# EAGLE board perspection-v1 (EAGLE 6.6.0), part 1 of 2
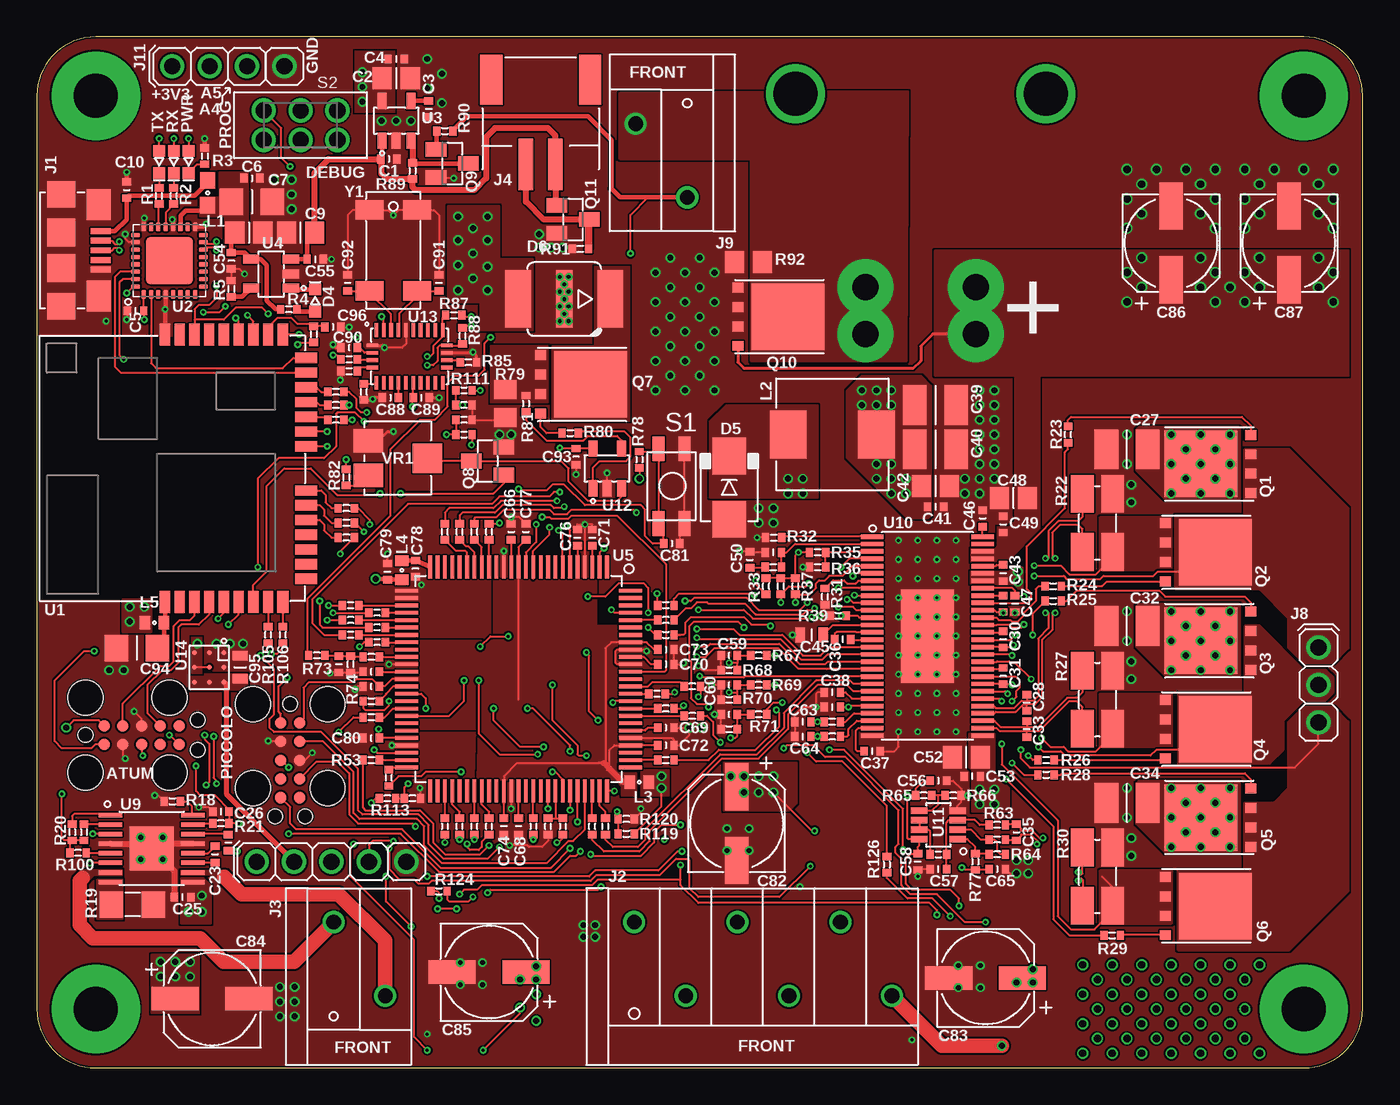
[diagram p8: board, top side]
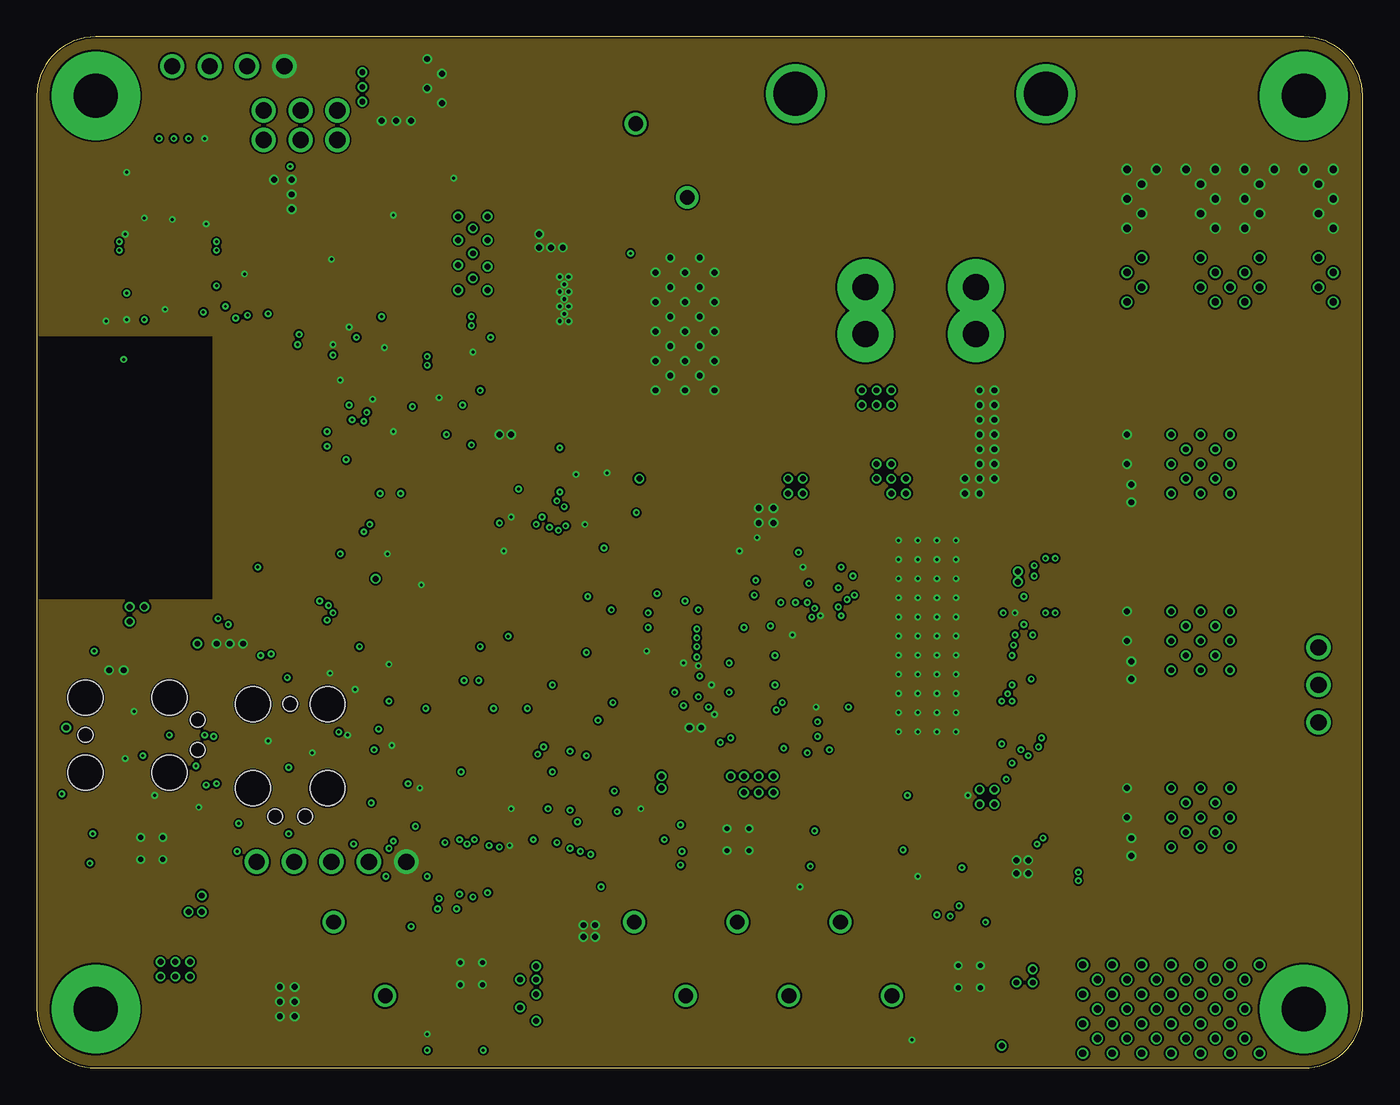
[diagram p9: board, inner layer Route2]
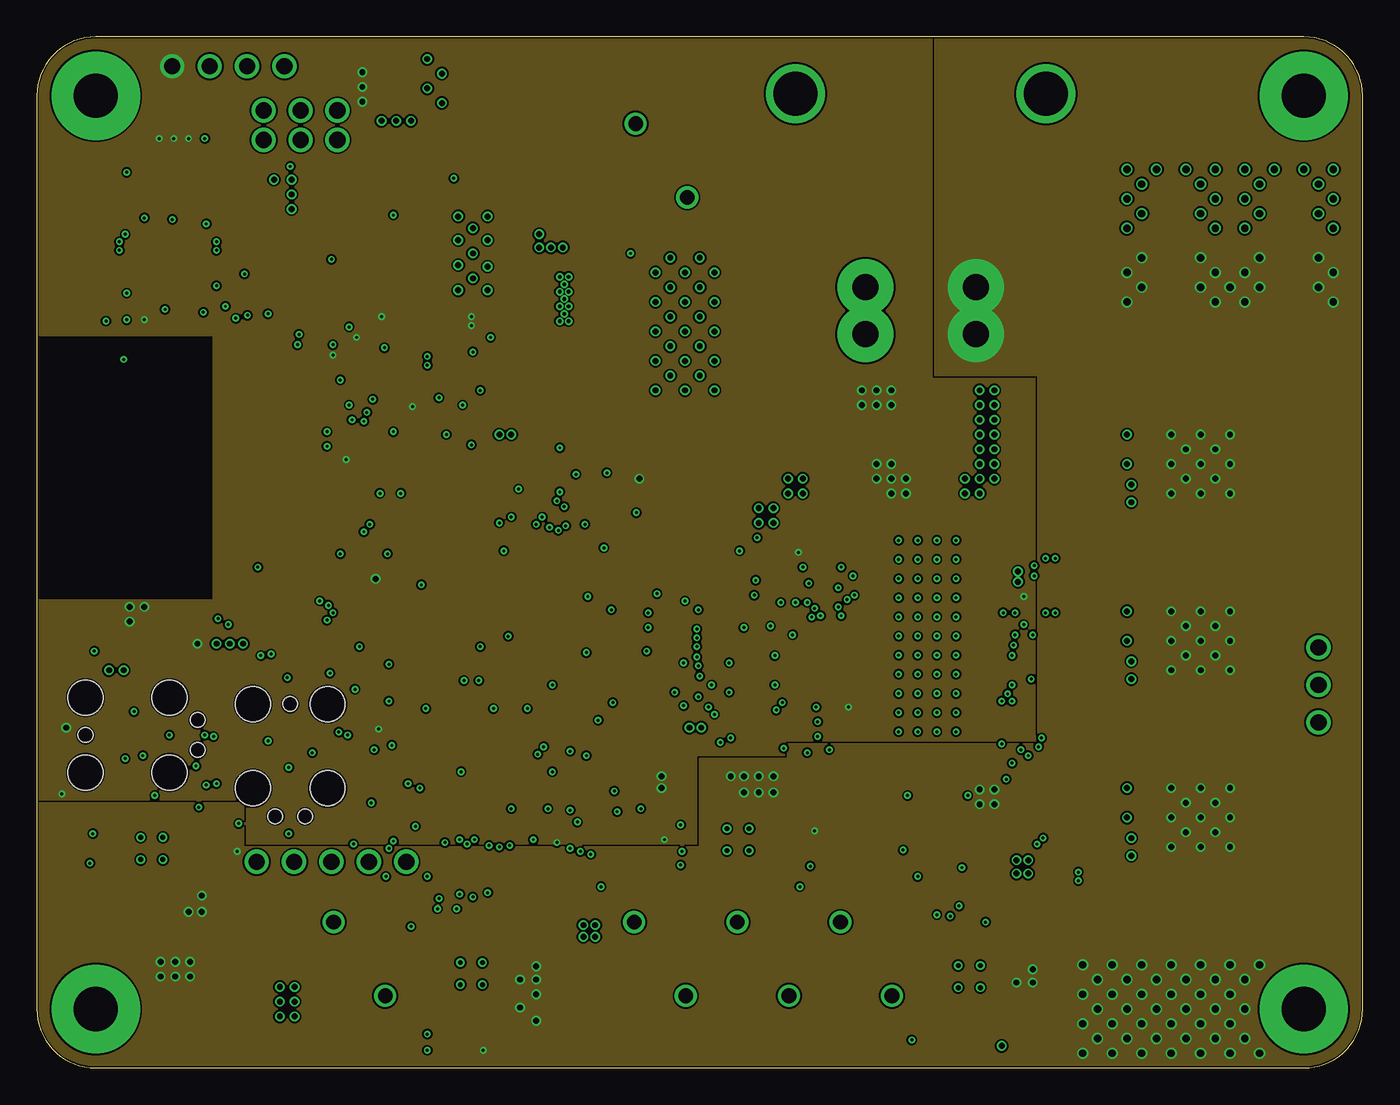
[diagram p10: board, inner layer Route15]
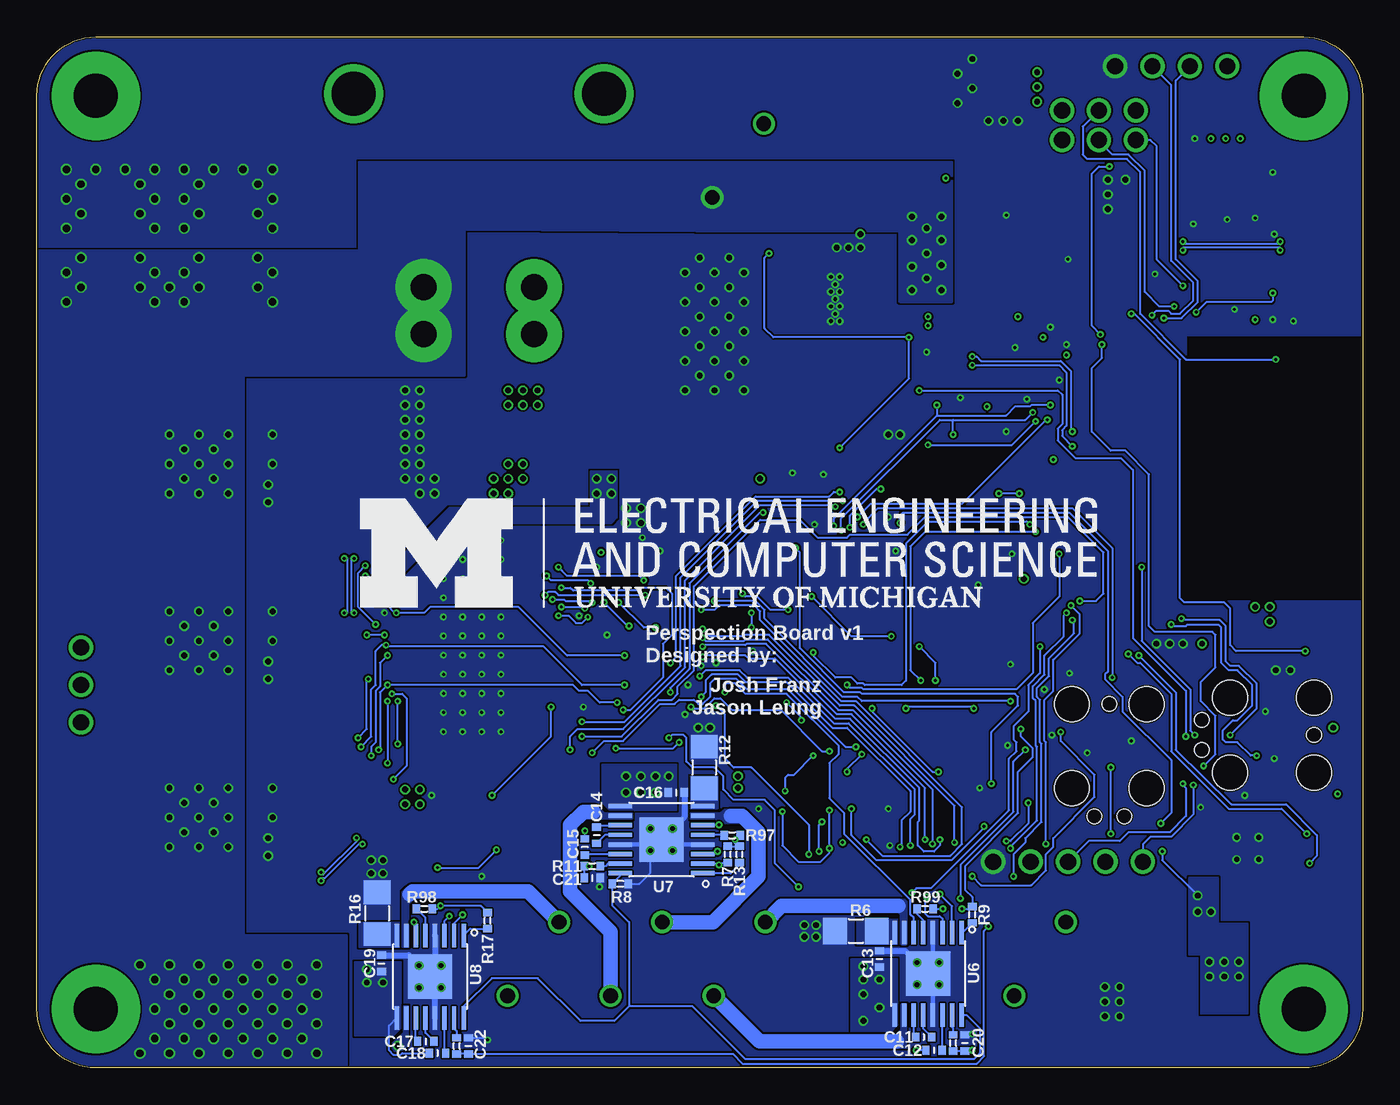
[diagram p11: board, bottom side, seen from below]

Size 90 x 70 mm. Coordinates in mm from the lower left corner, seen from the top.
Outline: 4,0 86,0 arc90 90,4 90,66 arc90 86,70 4,70 arc90 0,66 0,4 arc90 4,0
Copper layers (1*2*15*16): Top 0.035mm / dielectric 1.5mm / Route2 0.035mm / dielectric 0.15mm / Route15 0.035mm / dielectric 0.2mm / Bottom 0.035mm
Design rules "default *": minimum track width 5mil, minimum drill 0.2mm, track to track 5mil, track to pad 5mil, pad to pad 5mil, via to via 5mil, smd to smd 0mil, copper to edge 5mil, drill to drill 8mil, minimum pad ring 5mil, minimum via ring 5mil, stop-mask expansion 4mil, vias tented up to drill 8mil, thermal gap 10mil

## Footprints (pad centres in the part's own frame; a part is rotated, then mirrored left to right if it is on the bottom)
C0402 = smd 0.5 x 0.6: 1 -0.55,0; 2 0.55,0
C0805 = smd 1.3 x 1.5: 1 -0.95,0; 2 0.95,0
C1206 = smd 1.6 x 1.8: 1 -1.4,0; 2 1.4,0
C1210 = smd 1.6 x 2.7: 1 -1.4,0; 2 1.4,0
C0603 = smd 0.65 x 1: 1 -0.775,0; 2 0.775,0
PANASONIC-6.3MM-SMD = smd 1.6 x 3.2: NEG 0,-2.5; POS 0,2.5
LED0603 = smd 0.8 x 0.8: ANODE -0.75,0; CATHODE 0.75,0
SMB = smd 2.5 x 2.3: A 2.15,0; C -2.15,0
XLAMP-MX3 = smd 1.75 x 3.9: ANODE -3.125,0; CATHODE 3.125,0 | smd 1.1 x 3.9: THERM 0,0 | drill 0.254 pad 0.406: THERM1 0,0; THERM2 0,1; THERM3 0,-1; THERM4 -0.3,1.5; THERM5 0.3,1.5; THERM6 -0.3,0.5; THERM7 0.3,0.5; THERM8 -0.3,-0.5; THERM9 0.3,-0.5; THERM10 0.3,-1.5; THERM11 -0.3,-1.5
MICRO-USB = smd 0.4 x 1.35: 1 -1.3,4.125; 2 -0.65,4.125; 3 0,4.125; 4 0.65,4.125; 5 1.3,4.125 | smd 2.1 x 1.6: CASE1 -3.1,4; CASE2 3.1,4 | smd 1.8 x 1.9: CASE3 -3.8,1.45; CASE6 3.8,1.45 | smd 1.9 x 1.9: CASE4 -1.2,1.45; CASE5 1.2,1.45
3.5MM_PTSA_1.5/6-3.5-Z = drill 1: 1 -8.75,5; 2 -5.25,0; 3 -1.75,5; 4 1.75,0; 5 5.25,5; 6 8.75,0
3.5MM_PTSA_1.5/2-3.5-Z = drill 1: 1 -1.75,5; 2 1.75,0
JST-PH-2-SMD = smd 1 x 3.5: 1 1,-7.25; 2 -1,-7.25 | smd 1.5 x 3.4: CASE1 3.35,-1.5; CASE2 -3.35,-1.5
MOLEX_SABRE_2POS = drill 1.778 pad 3.81: N 3.747,0; N2 3.747,3.175; P -3.747,3.175; P2 -3.747,0 | drill 2.997: NC -8.496,-13.132; NC2 8.496,-13.132
TC2050-IDC = smd 0.787 x 0.787: 1 1.27,0.635; 2 2.54,0.635; 3 3.81,0.635; 4 5.08,0.635; 5 6.35,0.635; 6 6.35,-0.635; 7 5.08,-0.635; 8 3.81,-0.635; 9 2.54,-0.635; 10 1.27,-0.635 | hole 0.991: 7.62,1.016; 7.62,-1.016; 0,0 | hole 2.375: 0,2.54; 0,-2.54; 5.715,2.54; 5.715,-2.54
1X3_0.1IN_THRUHOLE = drill 1.1: 1 -2.54,0; 2 0,0; 3 2.54,0
1X5_0.1IN_THRUHOLE = drill 1.1: 1 -5.08,0; 2 -2.54,0; 3 0,0; 4 2.54,0; 5 5.08,0
1X4_0.1IN_THRUHOLE = drill 1.1: 1 -3.81,0; 2 -1.27,0; 3 1.27,0; 4 3.81,0
L0603 = smd 1.1 x 1: 1 -0.85,0; 2 0.85,0
DR74 = smd 2.5 x 3.25: 1 -3,0; 2 3,0
L0402 = smd 0.7 x 0.9: 1 -0.65,0; 2 0.65,0
SON-5X6 = smd 4.51 x 4.95: D 0,0 | smd 0.675 x 0.75: G 1.98,-3.405; S1 -1.98,-3.405; S2 -0.66,-3.405; S3 0.66,-3.405
SOT23 = smd 1 x 1.4: 1 -0.95,-1.1; 2 0.95,-1.1; 3 0,1.1
R0402 = smd 0.5 x 0.6: 1 -0.55,0; 2 0.55,0
R1206 = smd 1.6 x 1.803: 1 -1.422,0; 2 1.422,0
R2010-4 = smd 1.55 x 2.55: I1 -1.025,1.975; I2 -1.025,-1.975; V1 1.025,1.975; V2 1.025,-1.975
R0805 = smd 1.3 x 1.5: 1 -0.95,0; 2 0.95,0
EVQP2 = smd 1.676 x 0.813: 1 -2.54,-0.87; 2 -2.54,0.908; 3 2.54,-0.87; 4 2.54,0.908
SSA22/DPDT = drill 1.092: A1 2.5,1; A2 2.5,-1; B1 -2.5,1; B2 -2.5,-1; COM1 0,1; COM2 0,-1
ATUM = smd 1.5 x 0.7: 1 -9.079,0.5; 2 -9.079,-0.5; 3 -9.079,-1.5; 4 -9.079,-2.5; 5 -9.079,-3.5; 6 -9.079,-4.5; 7 -9.079,-5.5; 8 -9.079,-6.5; 24 9.079,-7.5; 25 9.079,-6.5; 26 9.079,-5.5; 27 9.079,-4.5; 28 9.079,-3.5; 29 9.079,-2.5; 30 9.079,-1.5; 31 9.079,-0.5; 32 9.079,0.5 | smd 1.5 x 0.754: 9 -9.079,-7.5 | smd 0.7 x 1.5: 10 -7.5,-9.079; 11 -6.5,-9.079; 12 -5.5,-9.079; 13 -4.5,-9.079; 14 -3.5,-9.079; 15 -2.5,-9.079; 16 -1.5,-9.079; 17 1.5,-9.079; 18 2.5,-9.079; 19 3.5,-9.079; 20 4.5,-9.079; 21 5.5,-9.079; 22 6.5,-9.079; 23 7.5,-9.079
QFN32 = smd 0.6 x 0.3: 1 -2.3,1.75; 2 -2.3,1.25; 3 -2.3,0.75; 4 -2.3,0.25; 5 -2.3,-0.25; 6 -2.3,-0.75; 7 -2.3,-1.25; 8 -2.3,-1.75; 17 2.3,-1.75; 18 2.3,-1.25; 19 2.3,-0.75; 20 2.3,-0.25; 21 2.3,0.25; 22 2.3,0.75; 23 2.3,1.25; 24 2.3,1.75 | smd 0.3 x 0.6: 9 -1.75,-2.3; 10 -1.25,-2.3; 11 -0.75,-2.3; 12 -0.25,-2.3; 13 0.25,-2.3; 14 0.75,-2.3; 15 1.25,-2.3; 16 1.75,-2.3; 25 1.75,2.3; 26 1.25,2.3; 27 0.75,2.3; 28 0.25,2.3; 29 -0.25,2.3; 30 -0.75,2.3; 31 -1.25,2.3; 32 -1.75,2.3 | smd 3.2 x 3.2: EXP 0,0
SOT23-5 = smd 0.6 x 1.1: 1 -0.95,-1.35; 2 0,-1.35; 3 1,-1.35; 4 1,1.35; 5 -0.95,1.35
TI-LQFP-100 = smd 0.25 x 1.55: 1 -6,-7.6; 2 -5.5,-7.6; 3 -5,-7.6; 4 -4.5,-7.6; 5 -4,-7.6; 6 -3.5,-7.6; 7 -3,-7.6; 8 -2.5,-7.6; 9 -2,-7.6; 10 -1.5,-7.6; 11 -1,-7.6; 12 -0.5,-7.6; 13 0,-7.6; 14 0.5,-7.6; 15 1,-7.6; 16 1.5,-7.6; 17 2,-7.6; 18 2.5,-7.6; 19 3,-7.6; 20 3.5,-7.6; 21 4,-7.6; 22 4.5,-7.6; 23 5,-7.6; 24 5.5,-7.6; 25 6,-7.6; 51 6,7.6; 52 5.5,7.6; 53 5,7.6; 54 4.5,7.6; 55 4,7.6; 56 3.5,7.6; 57 3,7.6; 58 2.5,7.6; 59 2,7.6; 60 1.5,7.6; 61 1,7.6; 62 0.5,7.6; 63 0,7.6; 64 -0.5,7.6; 65 -1,7.6; 66 -1.5,7.6; 67 -2,7.6; 68 -2.5,7.6; 69 -3,7.6; 70 -3.5,7.6; 71 -4,7.6; 72 -4.5,7.6; 73 -5,7.6; 74 -5.5,7.6; 75 -6,7.6 | smd 1.55 x 0.25: 26 7.6,-6; 27 7.6,-5.5; 28 7.6,-5; 29 7.6,-4.5; 30 7.6,-4; 31 7.6,-3.5; 32 7.6,-3; 33 7.6,-2.5; 34 7.6,-2; 35 7.6,-1.5; 36 7.6,-1; 37 7.6,-0.5; 38 7.6,0; 39 7.6,0.5; 40 7.6,1; 41 7.6,1.5; 42 7.6,2; 43 7.6,2.5; 44 7.6,3; 45 7.6,3.5; 46 7.6,4; 47 7.6,4.5; 48 7.6,5; 49 7.6,5.5; 50 7.6,6; 76 -7.6,6; 77 -7.6,5.5; 78 -7.6,5; 79 -7.6,4.5; 80 -7.6,4; 81 -7.6,3.5; 82 -7.6,3; 83 -7.6,2.5; 84 -7.6,2; 85 -7.6,1.5; 86 -7.6,1; 87 -7.6,0.5; 88 -7.6,0; 89 -7.6,-0.5; 90 -7.6,-1; 91 -7.6,-1.5; 92 -7.6,-2; 93 -7.6,-2.5; 94 -7.6,-3; 95 -7.6,-3.5; 96 -7.6,-4; 97 -7.6,-4.5; 98 -7.6,-5; 99 -7.6,-5.5; 100 -7.6,-6
TI-HTSSOP-16 = smd 0.3 x 1.6: 1 -2.275,-2.8; 2 -1.625,-2.8; 3 -0.975,-2.8; 4 -0.325,-2.8; 5 0.325,-2.8; 6 0.975,-2.8; 7 1.625,-2.8; 8 2.275,-2.8; 9 2.275,2.8; 10 1.625,2.8; 11 0.975,2.8; 12 0.325,2.8; 13 -0.325,2.8; 14 -0.975,2.8; 15 -1.625,2.8; 16 -2.275,2.8 | smd 3 x 3: PAD 0,0 | drill 0.33: THERM1 -0.75,0.75; THERM2 0.75,0.75; THERM3 -0.75,-0.75; THERM4 0.75,-0.75
TI-HTSSOP-56 = smd 0.3 x 1.55: 1 -6.75,-3.75; 2 -6.25,-3.75; 3 -5.75,-3.75; 4 -5.25,-3.75; 5 -4.75,-3.75; 6 -4.25,-3.75; 7 -3.75,-3.75; 8 -3.25,-3.75; 9 -2.75,-3.75; 10 -2.25,-3.75; 11 -1.75,-3.75; 12 -1.25,-3.75; 13 -0.75,-3.75; 14 -0.25,-3.75; 15 0.25,-3.75; 16 0.75,-3.75; 17 1.25,-3.75; 18 1.75,-3.75; 19 2.25,-3.75; 20 2.75,-3.75; 21 3.25,-3.75; 22 3.75,-3.75; 23 4.25,-3.75; 24 4.75,-3.75; 25 5.25,-3.75; 26 5.75,-3.75; 27 6.25,-3.75; 28 6.75,-3.75; 29 6.75,3.75; 30 6.25,3.75; 31 5.75,3.75; 32 5.25,3.75; 33 4.75,3.75; 34 4.25,3.75; 35 3.75,3.75; 36 3.25,3.75; 37 2.75,3.75; 38 2.25,3.75; 39 1.75,3.75; 40 1.25,3.75; 41 0.75,3.75; 42 0.25,3.75; 43 -0.25,3.75; 44 -0.75,3.75; 45 -1.25,3.75; 46 -1.75,3.75; 47 -2.25,3.75; 48 -2.75,3.75; 49 -3.25,3.75; 50 -3.75,3.75; 51 -4.25,3.75; 52 -4.75,3.75; 53 -5.25,3.75; 54 -5.75,3.75; 55 -6.25,3.75; 56 -6.75,3.75 | smd 6.35 x 3.61: 57 0,0 | drill 0.2 pad 0.406: P$58 0,0.65; P$59 0,1.95; P$60 0,-1.95; P$61 0,-0.65; P$62 1.3,0.65; P$63 1.3,1.95; P$64 1.3,-1.95; P$65 1.3,-0.65; P$66 2.6,0.65; P$67 2.6,1.95; P$68 2.6,-1.95; P$69 2.6,-0.65; P$70 3.9,0.65; P$71 3.9,1.95; P$72 3.9,-1.95; P$73 3.9,-0.65; P$74 5.2,0.65; P$75 5.2,1.95; P$76 5.2,-1.95; P$77 5.2,-0.65; P$78 6.5,0.65; P$79 6.5,1.95; P$80 6.5,-1.95; P$81 6.5,-0.65; P$82 -1.3,0.65; P$83 -1.3,1.95; P$84 -1.3,-1.95; P$85 -1.3,-0.65; P$86 -2.6,0.65; P$87 -2.6,1.95; P$88 -2.6,-1.95; P$89 -2.6,-0.65; P$90 -3.9,0.65; P$91 -3.9,1.95; P$92 -3.9,-1.95; P$93 -3.9,-0.65; P$94 -5.2,0.65; P$95 -5.2,1.95; P$96 -5.2,-1.95; P$97 -5.2,-0.65; P$98 -6.5,0.65; P$99 -6.5,1.95; P$100 -6.5,-1.95; P$101 -6.5,-0.65
TI-SOT23-8 = smd 0.45 x 1.1: 1 -0.975,-1.3; 2 -0.325,-1.3; 3 0.325,-1.3; 4 0.975,-1.3; 5 0.975,1.3; 6 0.325,1.3; 7 -0.325,1.3; 8 -0.975,1.3
LGA-28 = smd 0.925 x 0.25: 1 1.788,2.25; 6 -1.788,2.25; 7 -1.788,1.75; 8 -1.788,1.25; 9 -1.788,0.75; 10 -1.788,0.25; 11 -1.788,-0.25; 12 -1.788,-0.75; 13 -1.788,-1.25; 14 -1.788,-1.75; 15 -1.788,-2.25; 20 1.788,-2.25; 21 1.788,-1.75; 22 1.788,-1.25; 23 1.788,-0.75; 24 1.788,-0.25; 25 1.788,0.25; 26 1.788,0.75; 27 1.788,1.25; 28 1.788,1.75 | smd 0.25 x 0.8: 2 0.75,2.525; 3 0.25,2.525; 4 -0.25,2.525; 5 -0.75,2.525; 16 -0.75,-2.525; 17 -0.25,-2.525; 18 0.25,-2.525; 19 0.75,-2.525
TI-SIP-9 = smd 0.35 x 0.35: A1 -1,1; A2 0,1; A3 1,1; B1 -1,0; B2 0,0; B3 1,0; C1 -1,-1; C2 0,-1; C3 1,-1
ST-4EA = smd 1.6 x 2: 1 1.175,-2; 3 -1.175,-2 | smd 2 x 2: 2 0,2
SOJ-4 = smd 1.3 x 1.9: 1 -2.75,-1.6; 2 2.75,-1.6; 3 2.75,1.6; 4 -2.75,1.6

## Placement (x,y rotation side)
C1  0.1uF  [C0402]  23.9,61.7 0 top
C2  4.7uF  [C0805]  24.4,67.2 0 top
C3  0.01uF  [C0402]  26.6,65.1 270 top
C4  0.1uF  [C0402]  24.4,68.5 0 top
C5  0.1uF  [C0402]  6.7,51.4 180 top
C6  0.1uF  [C0402]  14.6,60.4 0 top
C7  10uF  [C1206]  14.6,58.8 0 top
C8  4.7uF  [C0805]  14.4,56.7 0 top
C9  4.7uF  [C0805]  17.9,56.7 180 top
C10  0.1uF  [C0402]  6.1,59.6 90 top
C11  0.1uF  [C0402]  29.8,2.1 0 bottom
C12  0.1uF  [C0402]  29.1,1.2 0 bottom
C13  0.1uF  [C0402]  32.8,7.4 90 bottom
C14  0.1uF  [C0402]  52,15.8 270 bottom
C15  0.1uF  [C0402]  52.8,15 270 bottom
C16  0.1uF  [C0402]  46.6,18.7 0 bottom
C17  0.1uF  [C0402]  63.6,1.8 0 bottom
C18  0.1uF  [C0402]  62.8,1 0 bottom
C19  0.1uF  [C0402]  66.6,7.1 90 bottom
C20  1000pF  [C0402]  27,1.7 90 bottom
C21  1000pF  [C0402]  52.3,12.9 0 bottom
C22  1000pF  [C0402]  60.7,1.5 90 bottom
C23  0.1uF  [C0402]  12.1,14.5 90 top
C24  0.1uF  [C0402]  13,15.3 90 top
C25  0.1uF  [C0402]  9.9,11.6 180 top
C26  1000pF  [C0402]  12.5,17.4 180 top
C27  2.2uF  [C1210]  74,42 180 top
C28  1000pF  [C0402]  67.2,24.8 90 top
C29  0.1uF  [C0402]  65.6,31.5 270 top
C30  0.1uF  [C0402]  65.6,29.1 270 top
C31  0.1uF  [C0402]  65.6,26.6 270 top
C32  2.2uF  [C1210]  74,30 180 top
C33  1000pF  [C0402]  67.2,23 90 top
C34  2.2uF  [C1210]  74,18 180 top
C35  1000pF  [C0402]  66.5,16 90 top
C36  0.022uF  [C0402]  54.7,29.1 0 top
C37  1uF  [C0402]  56.7,21.5 0 top
C38  1uF  [C0402]  54,25.5 180 top
C39  22uF  [C1210]  61,45 0 top
C40  22uF  [C1210]  61,42 0 top
C41  0.1uF  [C0402]  61,38.1 0 top
C42  1uF  [C0805]  61,39.5 0 top
C43  0.1uF  [C0402]  65.6,33.6 90 top
C44  0.1uF  [C0402]  54,24.5 180 top
C45  2.2uF  [C0603]  52.6,29.4 180 top
C46  0.015uF  [C0402]  64.2,37.3 90 top
C47  0.1uF  [C0402]  66.4,31.5 270 top
C48  2.2uF  [C0805]  66.3,38.7 180 top
C49  0.1uF  [C0402]  65.6,36.9 90 top
C50  6800pF  [C0402]  48.4,34.5 90 top
C51  120pF  [C0402]  50,35 180 top
C52  2.2uF  [C0805]  63.1,21.1 180 top
C53  0.1uF  [C0402]  63.5,19.8 180 top
C54  0.1uF  [C0402]  13.2,54.8 270 top
C55  0.1uF  [C0402]  18.9,54.9 0 top
C56  0.1uF  [C0402]  61.2,19.5 0 top
C57  2.2uF  [C0402]  61.2,13.5 180 top
C58  0.1uF  [C0402]  59.8,14 270 top
C59  0.1uF  [C0402]  47,28 180 top
C60  0.1uF  [C0402]  47,26 180 top
C61  0.1uF  [C0402]  47,24 180 top
C62  0.1uF  [C0402]  20.5,27.4 270 top
C63  2200pF  [C0402]  52,23.5 180 top
C64  2200pF  [C0402]  52,22.5 180 top
C65  2200pF  [C0402]  65.2,13.5 0 top
C66  2.2uF  [C0402]  32.2,36.4 90 top
C67  2.2uF  [C0402]  22.7,26.9 180 top
C68  2.2uF  [C0402]  32.7,16.4 270 top
C69  2.2uF  [C0402]  42.7,23.1 0 top
C70  2.2uF  [C0402]  42.7,27.4 0 top
C71  2.2uF  [C0402]  37.7,36 90 top
C72  2.2uF  [C0402]  42.7,21.9 0 top
C73  2.2uF  [C0402]  42.7,28.4 0 top
C74  2.2uF  [C0402]  31.7,16.4 270 top
C75  2.2uF  [C0402]  22.7,25.9 180 top
C76  2.2uF  [C0402]  36.7,36 90 top
C77  2.2uF  [C0402]  33.2,36.4 90 top
C78  2.2uF  [C0402]  25.7,33.9 270 top
C79  2.2uF  [C0402]  23.8,33.7 90 top
C80  0.1uF  [C0402]  22.7,22.4 180 top
C81  0.1uF  [C0402]  43.1,35.6 0 top
C82  220uF  [PANASONIC-6.3MM-SMD]  47.5,16.6 0 top
C83  220uF  [PANASONIC-6.3MM-SMD]  64.4,6.1 270 top
C84  220uF  [PANASONIC-6.3MM-SMD]  11.9,4.7 90 top
C85  220uF  [PANASONIC-6.3MM-SMD]  30.7,6.5 270 top
C86  220uF  [PANASONIC-6.3MM-SMD]  77,56 180 top
C87  220uF  [PANASONIC-6.3MM-SMD]  85,56 180 top
C88  0.1uF  [C0402]  24,45.5 0 top
C89  0.1uF  [C0402]  26.1,45.5 0 top
C90  0.1uF  [C0402]  21.2,48.9 180 top
C91  12.5pF  [C0402]  27.3,53.3 90 top
C92  12.5pF  [C0402]  21.1,53.3 90 top
C93  0.1uF  [C0402]  36.6,41.5 270 top
C94  22uF  [C1206]  6.8,28.5 180 top
C95  4.7uF  [C0603]  13.8,27.2 90 top
C96  0.1uF  [C0402]  20.1,50.3 0 top
D1  LED0603  [LED0603]  8.3,61.5 270 top
D2  LED0603  [LED0603]  9.3,61.5 270 top
D3  LED0603  [LED0603]  10.3,61.5 270 top
D4  LED0603  [LED0603]  18.9,52.1 90 top
D5  B220A-13-F  [SMB]  47,39.4 270 top
D6  LED-PWR-XLAMP_MX3  [XLAMP-MX3]  35.8,52.2 0 top
J1  MICRO-USB-10118192-0001LF  [MICRO-USB]  0.2,55.5 270 top
J2  1X6-PTSA_1.5/6-3.5-Z  [3.5MM_PTSA_1.5/6-3.5-Z]  49.3,4.9 0 top
J3  1X2-PTSA_1.5/2-3.5-Z  [3.5MM_PTSA_1.5/2-3.5-Z]  21.9,4.9 0 top
J4  1X2-JST-PH-SMD  [JST-PH-2-SMD]  34.2,68.6 0 top
J5  1X2-0428202213  [MOLEX_SABRE_2POS]  60,53 180 top
J6  JTAG-ARM_TC-10  [TC2050-IDC]  3.3,22.6 0 top
J7  JTAG-ARM_TC-10  [TC2050-IDC]  17.2,24.7 270 top
J8  1X3-0.1IN_THRUHOLE  [1X3_0.1IN_THRUHOLE]  87,26 270 top
J9  1X2-PTSA_1.5/2-3.5-Z  [3.5MM_PTSA_1.5/2-3.5-Z]  42.4,64.1 180 top
J10  1X5  [1X5_0.1IN_THRUHOLE]  20,14 0 top
J11  1X4  [1X4_0.1IN_THRUHOLE]  13,68 0 top
L1  MI0603K300R-10  [L0603]  11.6,59.4 270 top
L2  33uH  [DR74]  54,43 180 top
L3  BLM15PD600SN1D  [L0402]  40.9,19.4 180 top
L4  BKP1005HS221-T  [L0402]  24.78,33.79 90 top
L5  BLM15PD600SN1D  [L0402]  7.98,30.22 0 top
Q1  NMOS-CSD18533Q5A  [SON-5X6]  79,41 90 top
Q2  NMOS-CSD18533Q5A  [SON-5X6]  80,35 270 top
Q3  NMOS-CSD18533Q5A  [SON-5X6]  79,29 90 top
Q4  NMOS-CSD18533Q5A  [SON-5X6]  80,23 270 top
Q5  NMOS-CSD18533Q5A  [SON-5X6]  79,17 90 top
Q6  NMOS-CSD18533Q5A  [SON-5X6]  80,11 270 top
Q7  NMOS-CSD18533Q5A  [SON-5X6]  37.6,46.4 270 top
Q8  BSS138L  [SOT23]  30.6,41.2 90 top
Q9  BSS138L  [SOT23]  28.2,61.4 270 top
Q10  NMOS-CSD18533Q5A  [SON-5X6]  51,51 270 top
Q11  IRFML8244TRPBF  [SOT23]  36.4,57.6 270 top
R1  470  [R0402]  8.3,59.2 90 top
R2  470  [R0402]  9.3,59.2 90 top
R3  470  [R0402]  11.4,61.9 270 top
R4  470  [R0402]  17.1,51.5 180 top
R5  2k  [R0402]  13.2,52.9 270 top
R6  0.33  [R1206]  34.4,9.3 0 bottom
R7  10k  [R0402]  43.1,14.5 90 bottom
R8  10k  [R0402]  50.4,12.5 180 bottom
R9  10k  [R0402]  26.5,10.4 90 bottom
R10  100k  [R0402]  27.8,1.7 90 bottom
R11  100k  [R0402]  52.3,13.7 0 bottom
R12  0.33  [R1206]  44.7,20.4 270 bottom
R13  10k  [R0402]  42.3,14.5 90 bottom
R14  100k  [R0402]  61.5,1.5 90 bottom
R15  10k  [R0402]  3.2,16 270 top
R16  0.33  [R1206]  66.9,10.5 270 bottom
R17  10k  [R0402]  59.4,10 90 bottom
R18  10k  [R0402]  9.2,18.1 0 top
R19  0.33  [R1206]  6.5,11.1 180 top
R20  10k  [R0402]  2.4,16 270 top
R21  100k  [R0402]  12.5,16.6 180 top
R22  0.01  [R2010-4]  72,37 180 top
R23  10  [R0402]  70,43 90 top
R24  10  [R0402]  69,32.7 0 top
R25  10  [R0402]  69,31.7 0 top
R26  10  [R0402]  68.5,20.9 0 top
R27  0.01  [R2010-4]  72,25 180 top
R28  10  [R0402]  68.5,19.9 0 top
R29  10  [R0402]  73,9 0 top
R30  0.01  [R2010-4]  72,13 180 top
R31  1  [R0402]  53.5,32 90 top
R32  205k  [R0402]  50.01,36 0 top
R33  10k  [R0402]  49.5,32.7 90 top
R34  16.2k  [R0402]  50,34 0 top
R35  31.6k  [R0402]  53,35 180 top
R36  10k  [R0402]  53,34 0 top
R37  10k  [R0402]  51.5,32.7 90 top
R38  10k  [R0402]  50.5,32.7 90 top
R39  1k  [R0402]  54.4,30.7 0 top
R40  0  [R0402]  23.9,19.7 90 top
R41  0  [R0402]  42.7,30.4 180 top
R42  0  [R0402]  42.7,29.4 0 top
R43  0  [R0402]  22.7,27.9 180 top
R44  0  [R0402]  21.3,29.4 180 top
R45  0  [R0402]  29.7,36.4 90 top
R46  0  [R0402]  23.1,28.9 180 top
R47  0  [R0402]  27.7,36.4 90 top
R48  0  [R0402]  23.1,29.9 180 top
R49  0  [R0402]  28.7,36.4 90 top
R50  0  [R0402]  30.7,16.4 90 top
R51  0  [R0402]  29.7,16.4 90 top
R52  0  [R0402]  28.7,16.4 90 top
R53  0  [R0402]  22.7,20.9 0 top
R54  0  [R0402]  38.6,16.4 90 top
R55  0  [R0402]  37.7,16.4 90 top
R56  0  [R0402]  42.7,20.9 0 top
R57  0  [R0402]  42.7,31.4 180 top
R58  0  [R0402]  22.7,24.9 0 top
R59  0  [R0402]  27.7,16.4 270 top
R60  0  [R0402]  33.7,16.4 270 top
R61  10k  [R0402]  61.2,14.5 0 top
R62  1k  [R0402]  65.2,15.5 180 top
R63  1k  [R0402]  65.2,16.5 180 top
R64  10k  [R0402]  65.2,14.5 180 top
R65  10k  [R0402]  60.2,18.5 180 top
R66  10k  [R0402]  62.2,18.5 180 top
R67  34.8k  [R0402]  49,28 180 top
R68  4.99k  [R0402]  47,27 0 top
R69  34.8k  [R0402]  49,26 180 top
R70  4.99k  [R0402]  47,25 0 top
R71  34.8k  [R0402]  49,24 180 top
R72  4.99k  [R0402]  47,23 0 top
R73  34.8k  [R0402]  19,28 180 top
R74  4.99k  [R0402]  21.3,27.4 90 top
R75  56  [R0402]  54,23.5 180 top
R76  56  [R0402]  54,22.5 180 top
R77  56  [R0402]  63.7,14 270 top
R78  2.2k  [R0402]  40.9,41.3 270 top
R79  0.68  [R0805]  31.8,45.1 90 top
R80  10  [R0402]  36.2,43.1 0 top
R81  0  [R0402]  33.2,45.1 270 top
R82  470k  [R0402]  21,40.1 270 top
R83  10k  [R0402]  22.2,45.9 90 top
R84  10k  [R0402]  21.2,47.3 0 top
R85  10k  [R0402]  29.3,47.9 180 top
R86  10k  [R0402]  21.2,48.1 180 top
R87  4.7k  [R0402]  28.3,51.1 0 top
R88  4.7k  [R0402]  28.9,49.7 90 top
R89  1k  [R0402]  25.5,60.9 270 top
R90  100  [R0402]  27.7,63.6 0 top
R91  DNP  [R0402]  36.9,55.6 180 top
R92  DNP  [R0805]  48.3,54.7 180 top
R93  0  [R0402]  21.3,30.4 180 top
R94  0  [R0402]  23.1,30.9 180 top
R95  0  [R0402]  21.3,31.4 180 top
R96  0  [R0402]  30.7,36.4 90 top
R97  10k  [R0402]  42.8,15.8 0 bottom
R98  10k  [R0402]  63.7,10.8 0 bottom
R99  10k  [R0402]  29.7,10.8 0 bottom
R100  10k  [R0402]  2.8,14.6 180 top
R101  0  [R0402]  44.5,25.9 180 top
R102  0  [R0402]  44.5,23.9 180 top
R103  0  [R0402]  42.7,24.4 180 top
R104  0  [R0402]  42.1,25.4 180 top
R105  0  [R0402]  15.7,29.4 90 top
R106  0  [R0402]  16.7,29.4 90 top
R107  0  [R0402]  20.3,45 180 top
R108  0  [R0402]  20.3,45.9 180 top
R109  23.2k  [R0402]  29,43 0 top
R110  45.2k  [R0402]  29,44 180 top
R111  23.2k  [R0402]  29,46 0 top
R112  45.2k  [R0402]  29,45 180 top
R113  23.2k  [R0402]  23.8,18.3 180 top
R114  45.2k  [R0402]  25.5,18.3 180 top
R115  0  [R0402]  21,37 180 top
R116  0  [R0402]  21,36 180 top
R117  0  [R0402]  20.3,44 180 top
R118  0  [R0402]  21,38 180 top
R119  820  [R0402]  40,15.9 0 top
R120  2.2k  [R0402]  40,16.9 180 top
R121  820  [R0402]  35.7,16.4 270 top
R122  2.2k  [R0402]  34.7,16.4 90 top
R123  0  [R0402]  18.8,49.8 270 top
R124  0  [R0402]  27.3,12 0 top
R125  0  [R0402]  22.7,23.8 180 top
R126  0  [R0402]  57.7,13.8 270 top
S1  TACTILE-SWITCH-EVQP2  [EVQP2]  43.1,39.5 90 top
S2  SSA22/DPDT  [SSA22/DPDT]  17.9,64 180 top
U1  ATUM  [ATUM]  9.2,40.7 90 top
U2  FT232RQ  [QFN32]  9,54.8 90 top
U3  TPS79933DDCR  [SOT23-5]  24.4,64.3 0 top
U4  MCP73831T-2ACI/OT  [SOT23-5]  15.9,53.9 90 top
U5  TMS320F28069MPZT  [TI-LQFP-100]  32.7,26.4 180 top
U6  DRV8801PWPR  [TI-HTSSOP-16]  29.5,6.4 180 bottom
U7  DRV8801PWPR  [TI-HTSSOP-16]  47.6,15.5 90 bottom
U8  DRV8801PWPR  [TI-HTSSOP-16]  63.3,6.2 180 bottom
U9  DRV8801PWPR  [TI-HTSSOP-16]  7.8,14.9 270 top
U10  DRV8301DCAR  [TI-HTSSOP-56]  60.45,29.32 270 top
U11  OPA2374AIDCNR  [TI-SOT23-8]  61.2,16.5 90 top
U12  OPA170AIDBVR  [SOT23-5]  38.7,40.7 0 top
U13  BNO055  [LGA-28]  25.3,48.3 90 top
U14  TPS81256  [TI-SIP-9]  11.7,27.2 270 top
U$1  [EECS_LOGO]  41.7,34.5 0 bottom
VR1  10k  [ST-4EA]  24.5,41.4 270 top
Y1  32.768kHz  [SOJ-4]  24.2,55.5 90 top